# Altium schematic sheet Control.SchDoc: Control
size A4; ApprovedBy: Ekrem Turan Fırat; CheckedBy: Ekrem Turan Fırat; Author: Ekrem Turan Fırat; CompanyName: Mergen Elektronik; DrawnBy: Ekrem T. Fırat; Engineer: Ekrem Turan Fırat; Organization: Mergen Elektronik; Address1: Türkiye; DocumentNumber: 20240101; Revision: v0.0.1; SheetNumber: 7; SheetTotal: 7
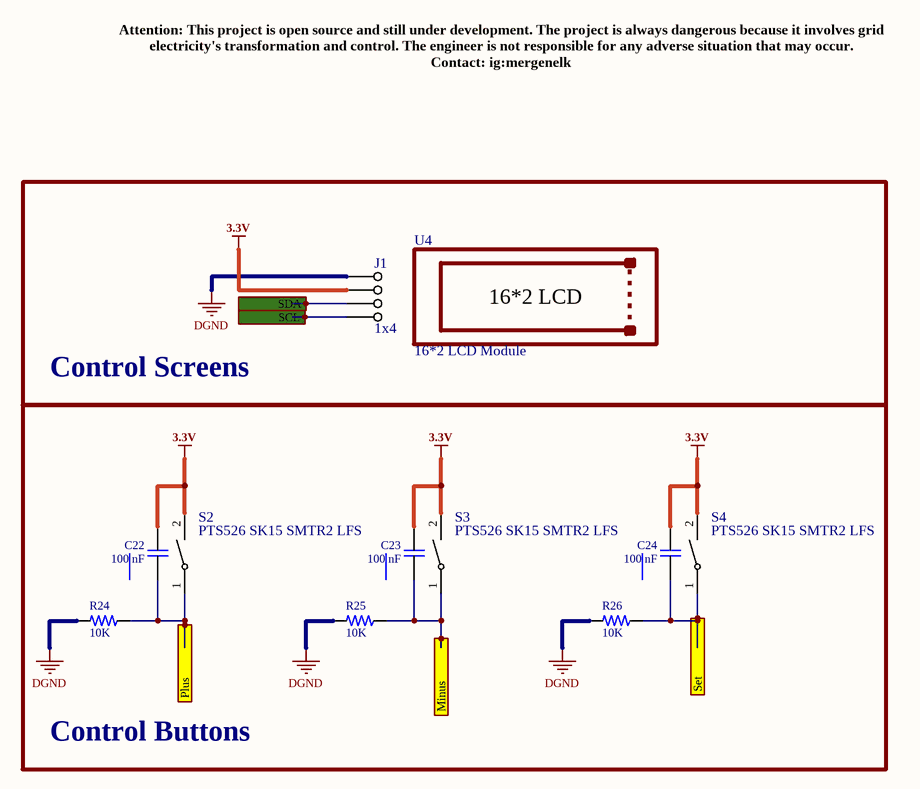
[diagram p0: Control.SchDoc]

## Parts
C22  100 nF  [MergenElektronik_Capacitors_Ceramics_SMDs_0603_S_NS]
C23  100 nF  [MergenElektronik_Capacitors_Ceramics_SMDs_0603_S_NS]
C24  100 nF  [MergenElektronik_Capacitors_Ceramics_SMDs_0603_S_NS]
J1  1x4  [MergenElektronik_Connectors_Headers_1x4_Male]
R24  10K  [MergenElektronik_Resistors_ChipResistors_0603_S_NS]
R25  10K  [MergenElektronik_Resistors_ChipResistors_0603_S_NS]
R26  10K  [MergenElektronik_Resistors_ChipResistors_0603_S_NS]
S2  PTS526 SK15 SMTR2 LFS  [MergenElektronik_Switches_TactileSwitches_PTS526]
S3  PTS526 SK15 SMTR2 LFS  [MergenElektronik_Switches_TactileSwitches_PTS526]
S4  PTS526 SK15 SMTR2 LFS  [MergenElektronik_Switches_TactileSwitches_PTS526]
U4  16*2 LCD Module  [MergenElektronik_Screens_LCDs_16x2Module]

## Blocks framed on the sheet
Control Screens: J1 U4
Control Buttons: C22-C24 R24-R26 S2-S4

## Ports
Minus (out, see MicroController[3B]), Plus (out, see MicroController[3B]), SCL (in, see MicroController[3B]), SDA (in, see MicroController[3B]), Set (out, see MicroController[3B])

## Nets
3.3V: C22.1 C23.1 C24.1 J1.3 S2.2 S3.2 S4.2
DGND: J1.4 R24.2 R25.2 R26.2
Minus: C23.2 R25.1 S3.1 ; port Minus
Plus: C22.2 R24.1 S2.1 ; port Plus
SCL: J1.1 ; port SCL
SDA: J1.2 ; port SDA
Set: C24.2 R26.1 S4.1 ; port Set

## Notes on the sheet
- Attention: This project is open source and still under development. The project is always dangerous because it involves grid electricity's transformation and control. The engineer is not responsible for any adverse situation that may occur.
  Contact: ig:mergenelk
- Title:
- Size:
- Date:
- A4
- Number:
- Time:
- Revision:
- Sheet
- of
- Project
- Drawn By :
- (in symbol MergenElektronik_Screens_LCDs_16x2Module) 16*2 LCD

## Library data of the parts
C22-C24 = MergenElektronik_Capacitors_Ceramic_SMDs_100nF_16V: Mergen Elektronik - Capacitors - Ceramics - SMDs - 0603 - 100 nF - 16V; Manufacturer: Samsung Electro-Mechanics; Manufacturer Number: CL10B104KO8NNNC; Model: Ceramic Capacitors; Tolerance: ±10%; Value: 100 nF; Temperature: -55°C up to +125°C; Digi-Key Number: 1276-1005-1-ND; Package: 0603(1608); Mouser Number: 187-CL10B104KO8NNNC; Mounting Type: Surface Mount; Farnell Number: 3013413; Supplier 1: Mouser; Supplier 2: Digi-Key; Supplier Part Number 1: 187-CL10B104KO8NNNC; Supplier Part Number 2: 1276-1005-6-ND; Özdisan Number: CL10B104KO8NNNC; Voltage Rated: 16V
J1 = MergenElektronik_Connectors_Headers_1x4_Male: Mergen Elektronik - Connectors - Headers - 1x4 Male
R24-R26 = MergenElektronik_Resistors_ChipResistors_0603_10K: Mergen Elektronik - Resistors - Chip Resistors - 0603 - 10K; Manufacturer: Stackpole Electronics Inc; Manufacturer Number: RMCF0603JT10K0; Value: Chip Resistor - 0603 - 10K; Power: 1/10W; Tolerance: ±5%; Package: 0603(1608); Temperature: -55°C up to +155°C - X8R; Model: Chip Resistor; Digi-Key Number: RMCF0603JT10K0CT-ND; Mounting Type: Surface Mount; Supplier 1: Digi-Key; Supplier Part Number 1: RMCF0603JT10K0-ND
S2-S4 = MergenElektronik_Switches_TactileSwitches_PTS526 SK15 SMTR2 LFS: Mergen Elektronik - Switches - Tactile  Switches - PTS526 SK15 SMTR2 LFS; Manufacturer: C&K; Current Rating: 50mA; Voltage Rated: 12VDC; Manufacturer Number: PTS526 SK15 SMTR2 LFS; Digi-Key Number: CKN12221-2-ND; Model: Tactile Switches; Mounting Type: Surface Mount; Package: PTS526; Temperature: -20°C up to +70°C; Value: PTS526 SK15 SMTR2 LFS; Mouser Number: 611-PTS526SK15SMR2L; Farnell Number: 3780596; Supplier 1: Digi-Key; Supplier 2: Mouser; Supplier Part Number 1: CKN12221-2-ND; Supplier Part Number 2: 611-PTS526SK15SMR2L
U4 = MergenElektronik_Screens_LCDs_16x2Module: Mergen Elektronik - Screens - LCDs - 16x2 Module